# Altium schematic sheet LED BELL.SchDoc
size A4
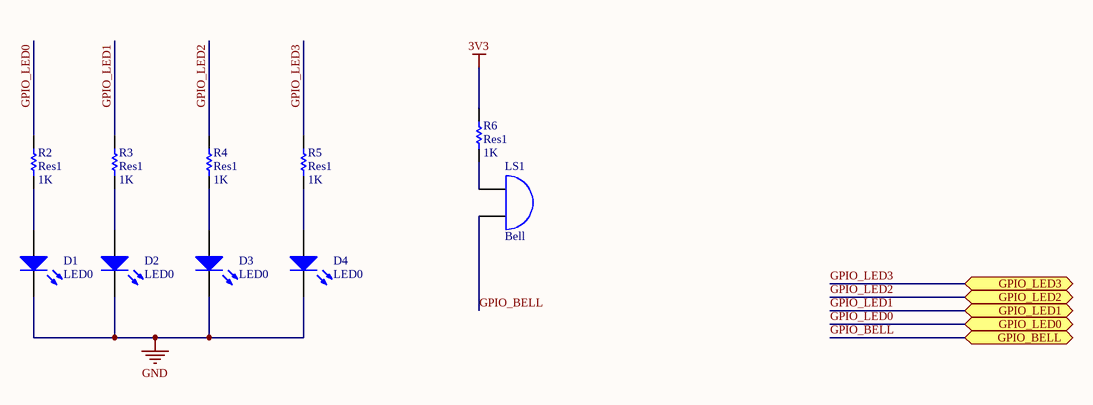
[diagram p0: LED BELL.SchDoc]

## Parts
D1  LED0  [LED_0603_BLUE]
D2  LED0  [LED_0603_BLUE]
D3  LED0  [LED_0603_GREEN]
D4  LED0  [LED_0603_GREEN]
LS1  Bell  [LED0805]
R2  Res1  value 1K  [RES_0603]
R3  Res1  value 1K  [RES_0603]
R4  Res1  value 1K  [RES_0603]
R5  Res1  value 1K  [RES_0603]
R6  Res1  value 1K  [RES_0603]

## Ports
GPIO_BELL, GPIO_LED0, GPIO_LED1, GPIO_LED2, GPIO_LED3

## Nets
3V3: R6.2
GND: D1.2(K) D2.2(K) D3.2(K) D4.2(K)
GPIO_BELL: LS1.2(B) ; port GPIO_BELL
GPIO_LED0: R2.2 ; port GPIO_LED0
GPIO_LED1: R3.2 ; port GPIO_LED1
GPIO_LED2: R4.2 ; port GPIO_LED2
GPIO_LED3: R5.2 ; port GPIO_LED3
NetD1_1: D1.1(A) R2.1
NetD2_1: D2.1(A) R3.1
NetD3_1: D3.1(A) R4.1
NetD4_1: D4.1(A) R5.1
NetLS1_1: LS1.1(A) R6.1

## Library data of the parts
D1-D4 = LED0: Typical INFRARED GaAs LED; Published: 8-Jun-2000; LatestRevisionDate: 08-Jul-2005; LatestRevisionNote: Mech Layer 1 removed.; PackageReference: LED-0; Publisher: Altium Limited; PackageDescription: LED; 2 Leads
LS1 = Bell: Electrical Bell; Published: 24-Mar-1999; LatestRevisionDate: 17-Jul-2002; LatestRevisionNote: Re-released for DXP Platform.; PackageReference: PIN2; Publisher: Altium Limited
R2-R6 = Res1: Resistor; Published: 8-Jun-2000; LatestRevisionDate: 17-Jul-2002; LatestRevisionNote: Re-released for DXP Platform.; PackageReference: AXIAL-0.3; Publisher: Altium Limited; PackageDescription: Axial Device, Thru-Hole; 2 Leads; 0.3 in Pin Spacing